# EAGLE design 2023-04-13 LN2 Autofill Connectors (EAGLE 9.6.2)
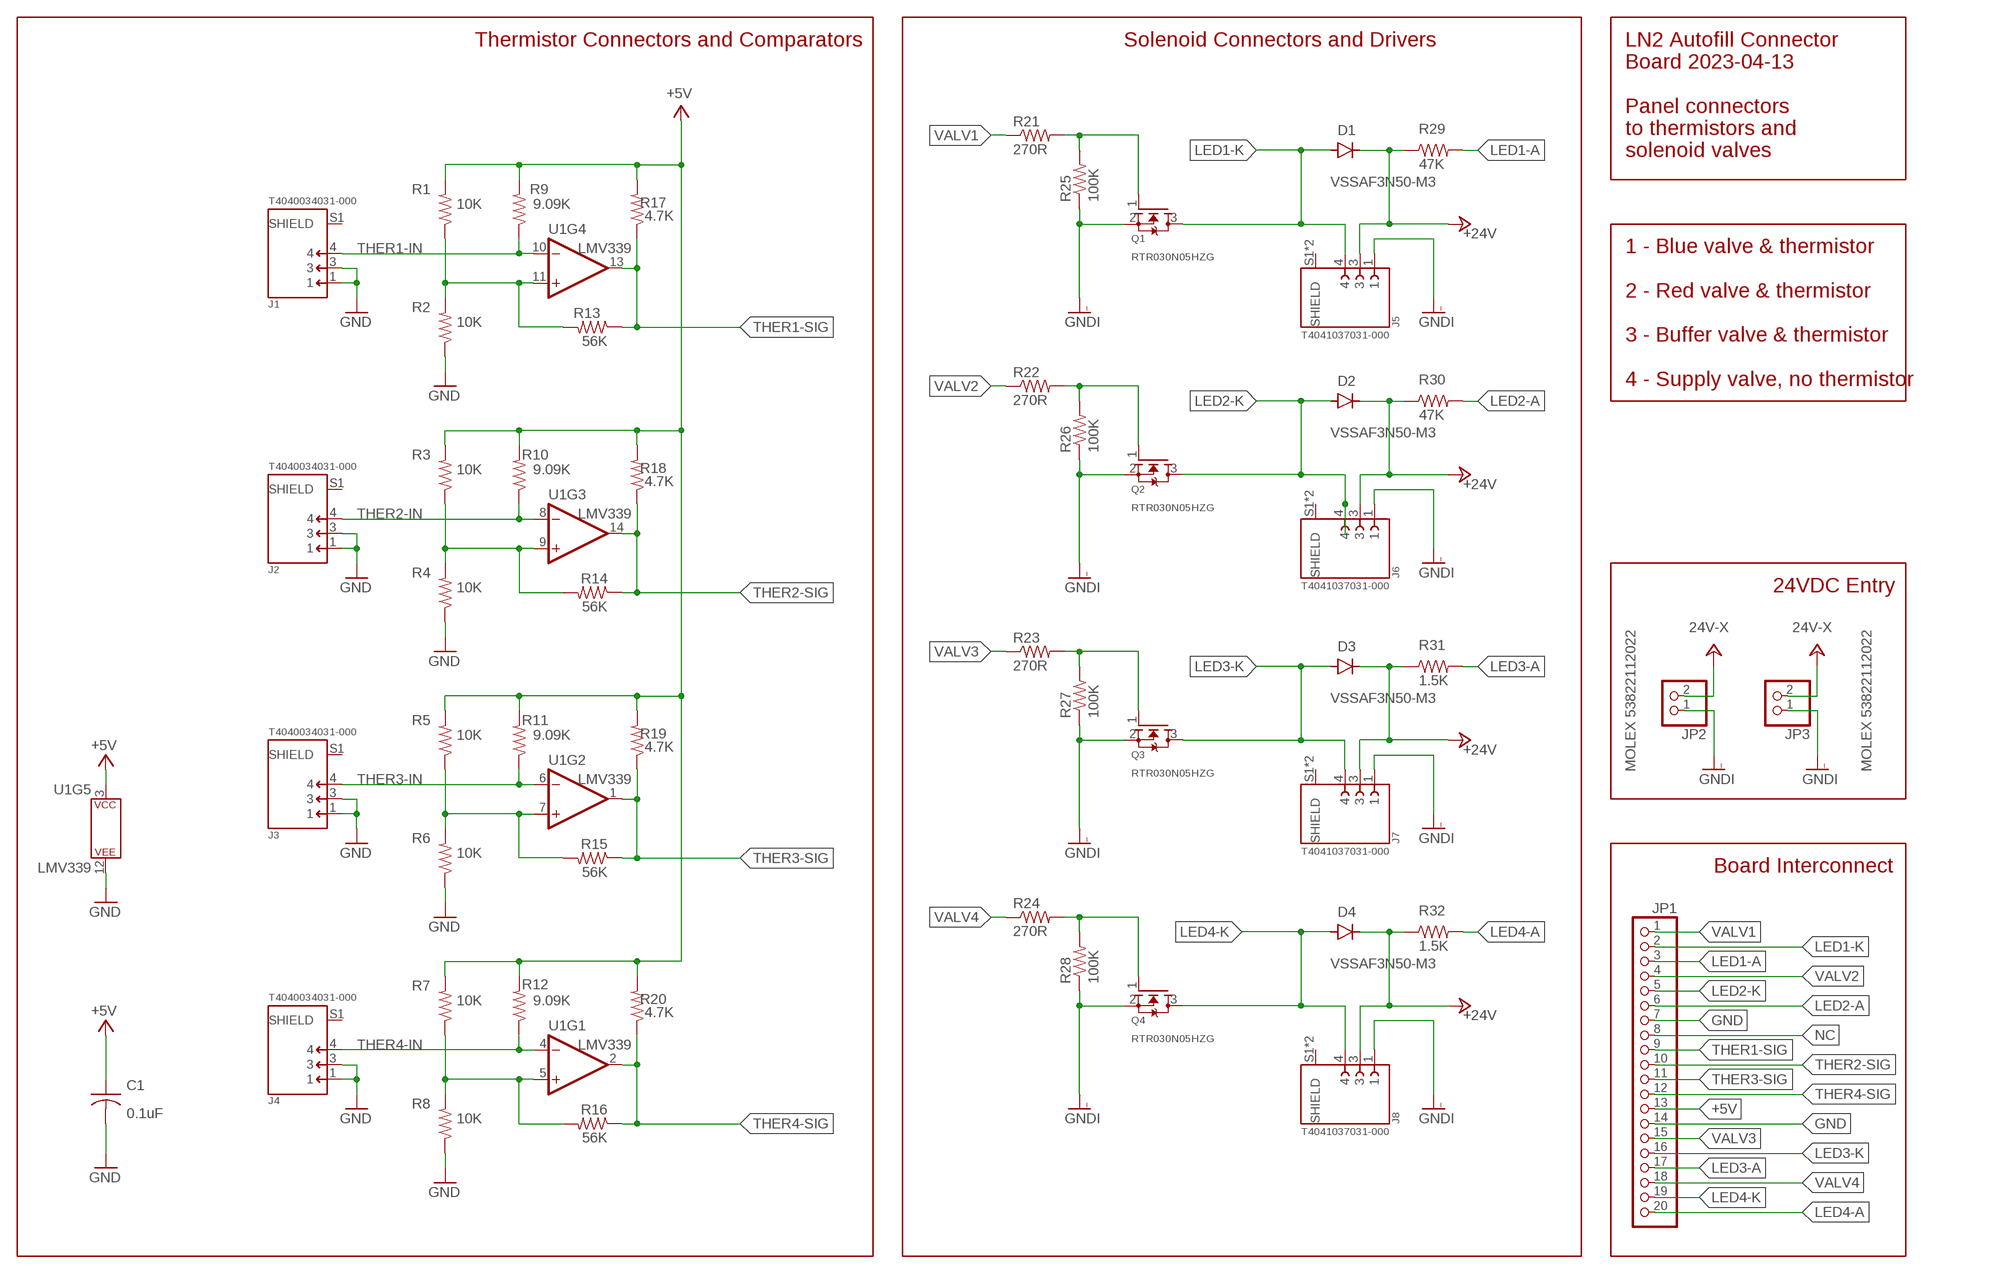
[diagram p0: schematic, sheet 1]

## Parts
C1  0.1uF  C-USC0805  [C0805]
D1  VSSAF3N50-M3  GF1  [SMA-DO214AC]
D2  VSSAF3N50-M3  GF1  [SMA-DO214AC]
D3  VSSAF3N50-M3  GF1  [SMA-DO214AC]
D4  VSSAF3N50-M3  GF1  [SMA-DO214AC]
J1  T4040034031-000  [TE_T4040034031-000]
J2  T4040034031-000  [TE_T4040034031-000]
J3  T4040034031-000  [TE_T4040034031-000]
J4  T4040034031-000  [TE_T4040034031-000]
J5  T4041037031-000  [TE_T4041037031-000]
J6  T4041037031-000  [TE_T4041037031-000]
J7  T4041037031-000  [TE_T4041037031-000]
J8  T4041037031-000  [TE_T4041037031-000]
JP1  PINHD-1X20  [1X20]
JP2  MOLEX 53822112022  PINHD-1X2MOLEX-02-VERT  [MOLEX-02-VERT]
JP3  MOLEX 53822112022  PINHD-1X2MOLEX-02-VERT  [MOLEX-02-VERT]
Q1  RTR030N05HZG  MOSFET-NREFLOW  [SOT23]
Q2  RTR030N05HZG  MOSFET-NREFLOW  [SOT23]
Q3  RTR030N05HZG  MOSFET-NREFLOW  [SOT23]
Q4  RTR030N05HZG  MOSFET-NREFLOW  [SOT23]
R1  10K  R-US_R0805  [R0805]
R2  10K  R-US_R0805  [R0805]
R3  10K  R-US_R0805  [R0805]
R4  10K  R-US_R0805  [R0805]
R5  10K  R-US_R0805  [R0805]
R6  10K  R-US_R0805  [R0805]
R7  10K  R-US_R0805  [R0805]
R8  10K  R-US_R0805  [R0805]
R9  9.09K  R-US_R0805  [R0805]
R10  9.09K  R-US_R0805  [R0805]
R11  9.09K  R-US_R0805  [R0805]
R12  9.09K  R-US_R0805  [R0805]
R13  56K  R-US_R0805  [R0805]
R14  56K  R-US_R0805  [R0805]
R15  56K  R-US_R0805  [R0805]
R16  56K  R-US_R0805  [R0805]
R17  4.7K  R-US_R0805  [R0805]
R18  4.7K  R-US_R0805  [R0805]
R19  4.7K  R-US_R0805  [R0805]
R20  4.7K  R-US_R0805  [R0805]
R21  270R  R-US_R0805  [R0805]
R22  270R  R-US_R0805  [R0805]
R23  270R  R-US_R0805  [R0805]
R24  270R  R-US_R0805  [R0805]
R25  100K  R-US_R0805  [R0805]
R26  100K  R-US_R0805  [R0805]
R27  100K  R-US_R0805  [R0805]
R28  100K  R-US_R0805  [R0805]
R29  47K  R-US_R0805  [R0805]
R30  47K  R-US_R0805  [R0805]
R31  1.5K  R-US_R0805  [R0805]
R32  1.5K  R-US_R0805  [R0805]
U1  LMV339  LM339SOIC-14  [SOIC127P599X175-14]

## Nets
+5V: C1.1 JP1.13 R1.2 R3.2 R5.2 R7.2 R9.2 R10.2 R11.2 R12.2 R17.2 R18.2 R19.2 R20.2 U1.3(P$V+)
+24V: D1.K(C) D2.K(C) D3.K(C) D4.K(C) J5.3 J6.3 J7.3 J8.3 JP2.2 JP3.2 R29.1 R30.1 R31.1 R32.1 ; supply symbol labelled 24V-X
GND: C1.2 J1.1 J1.3 J2.1 J2.3 J3.1 J3.3 J4.1 J4.3 JP1.7 JP1.14 R2.1 R4.1 R6.1 R8.1 U1.12(P$V-)
GNDI: J5.1 J6.1 J7.1 J8.1 JP2.1 JP3.1 Q1.2(S) Q2.2(S) Q3.2(S) Q4.2(S) R25.1 R26.1 R27.1 R28.1
LED1-A: JP1.3 R29.2
LED1-K: D1.A J5.4 JP1.2 Q1.3(D)
LED2-A: JP1.6 R30.2
LED2-K: D2.A J6.4 JP1.5 Q2.3(D)
LED3-A: JP1.17 R31.2
LED3-K: D3.A J7.4 JP1.16 Q3.3(D)
LED4-A: JP1.20 R32.2
LED4-K: D4.A J8.4 JP1.19 Q4.3(D)
N$1: Q1.1(G) R21.2 R25.2
N$2: Q2.1(G) R22.2 R26.2
N$3: Q3.1(G) R23.2 R27.2
N$4: Q4.1(G) R24.2 R28.2
NC: JP1.8
THER1-IN: J1.4 R9.1 U1.10(-IN)
THER1-SIG: JP1.9 R13.1 R17.1 U1.13(OUT)
THER2-IN: J2.4 R10.1 U1.8(-IN)
THER2-SIG: JP1.10 R14.1 R18.1 U1.14(OUT)
THER3-IN: J3.4 R11.1 U1.6(-IN)
THER3-SIG: JP1.11 R15.1 R19.1 U1.1(OUT)
THER4-IN: J4.4 R12.1 U1.4(-IN)
THER4-SIG: JP1.12 R16.1 R20.1 U1.2(OUT)
TRIM1: R1.1 R2.2 R13.2 U1.11(+IN)
TRIM2: R3.1 R4.2 R14.2 U1.9(+IN)
TRIM3: R5.1 R6.2 R15.2 U1.7(+IN)
TRIM4: R7.1 R8.2 R16.2 U1.5(+IN)
VALV1: JP1.1 R21.1
VALV2: JP1.4 R22.1
VALV3: JP1.15 R23.1
VALV4: JP1.18 R24.1
Unconnected: J1.S1(SHIELD) J2.S1(SHIELD) J3.S1(SHIELD) J4.S1(SHIELD) J5.S1(SHIELD) J5.S2(SHIELD) J6.S1(SHIELD) J6.S2(SHIELD) J7.S1(SHIELD) J7.S2(SHIELD) J8.S1(SHIELD) J8.S2(SHIELD)

## Notes on the sheet
- Thermistor Connectors and Comparators | Solenoid Connectors and Drivers
- LN2 Autofill Connector
  Board 2023-04-13
  
  Panel connectors
  to thermistors and
  solenoid valves
- 1 - Blue valve & thermistor
  
  2 - Red valve & thermistor
  
  3 - Buffer valve & thermistor
  
  4 - Supply valve, no thermistor
- 24VDC Entry
- Board Interconnect

## Library data of the parts
C1 = AUmlib:C-US: CAPACITOR, American symbol; SPICEPREFIX: C
D1-D4 = AUmlib:GF1: DIODE
J1-J4 = AUmlib:T4040034031-000: Male Receptacle Connector M8.FMLE.PNLREAR.3POS.STR PCBSHLD 3 POS; MANUFACTURER: TE; MAXIMUM_PACKAGE_HEIGHT: 15.7mm; PARTREV: Rev A; STANDARD: Manufacturer Recommendations
J5-J8 = AUmlib:T4041037031-000: Female Receptacle Connector M8.FMLE.PNLREAR.3POS.STR PCBSHLD 3 POS; MANUFACTURER: TE; MAXIMUM_PACKAGE_HEIGHT: 15.7mm; PARTREV: Rev A; STANDARD: Manufacturer Recommendations
JP1 = AUmlib:PINHD-1X20: PIN HEADER
JP2 JP3 = AUmlib:PINHD-1X2: PIN HEADER
Q1-Q4 = AUmlib:MOSFET-N: N-Channel Mosfet 2N7002E - 60V 260mA SOT23 [Digikey: 2N7002ET1GOSTR-ND] - REEL BSH103 - 30V 850mA SOT23 [Digikey: 568-5013-1-ND]
R1-R32 = AUmlib:R-US_: RESISTOR, American symbol; SPICEPREFIX: R
U1 = AUmlib:LM339: Quad Comparator - LM339PWR Based on information from the SLCS006N datasheet from TI (www.ti.com). Created by nick@scantool.net, 2008. Updated 2016. SparkFun Products SparkFun OBD-II UART <https://www.sparkfun.com/products/9555> (WIG-09555) SparkFun Car Diagnostics Kit <https://www.sparkfun.com/products/10769> (RTL-10769)

## Board
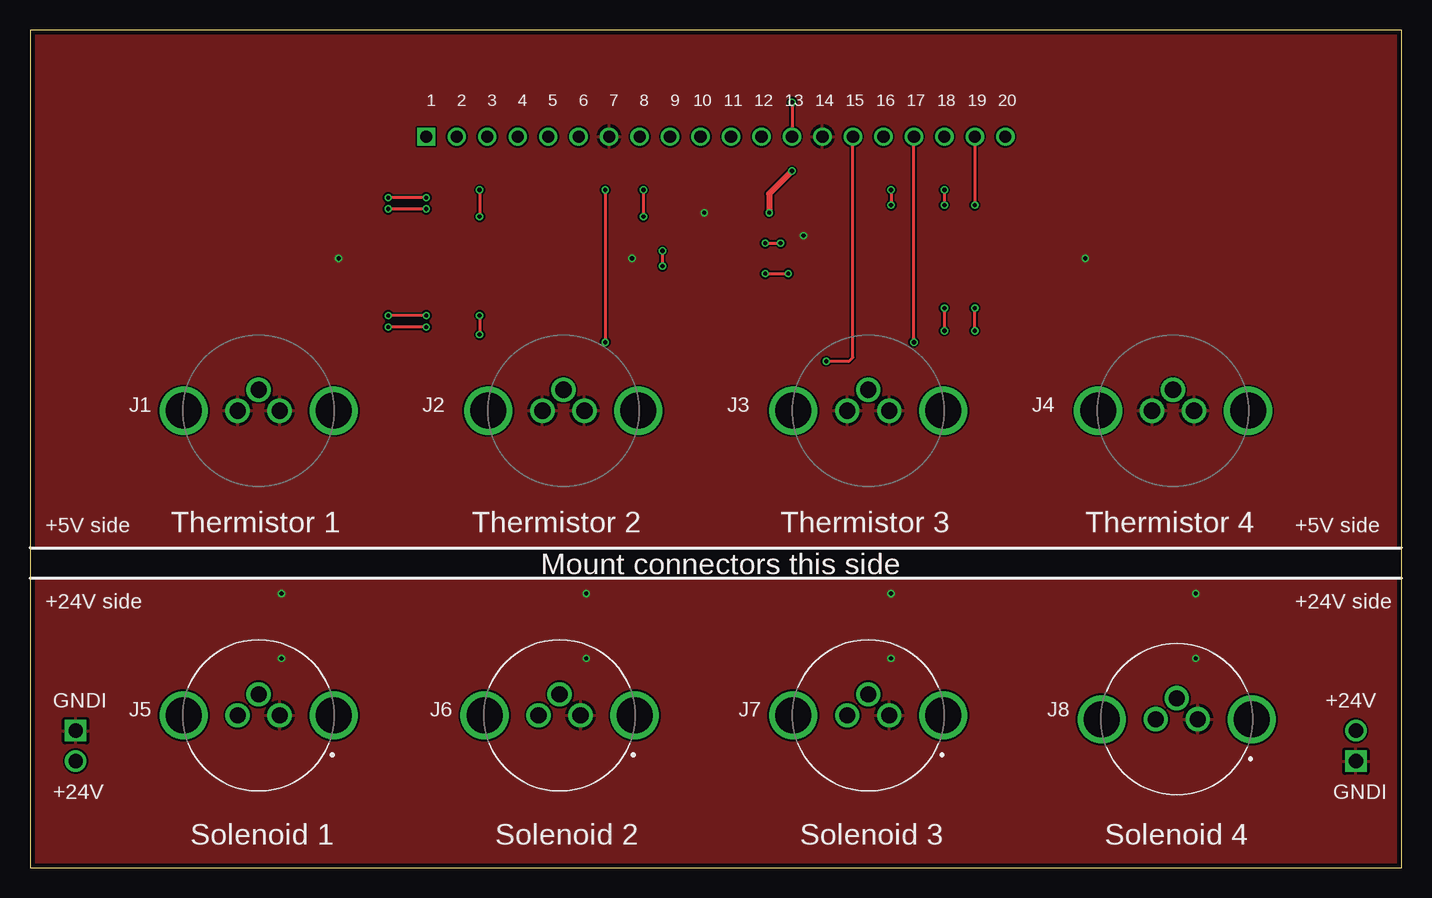
[diagram p1: board, top side]
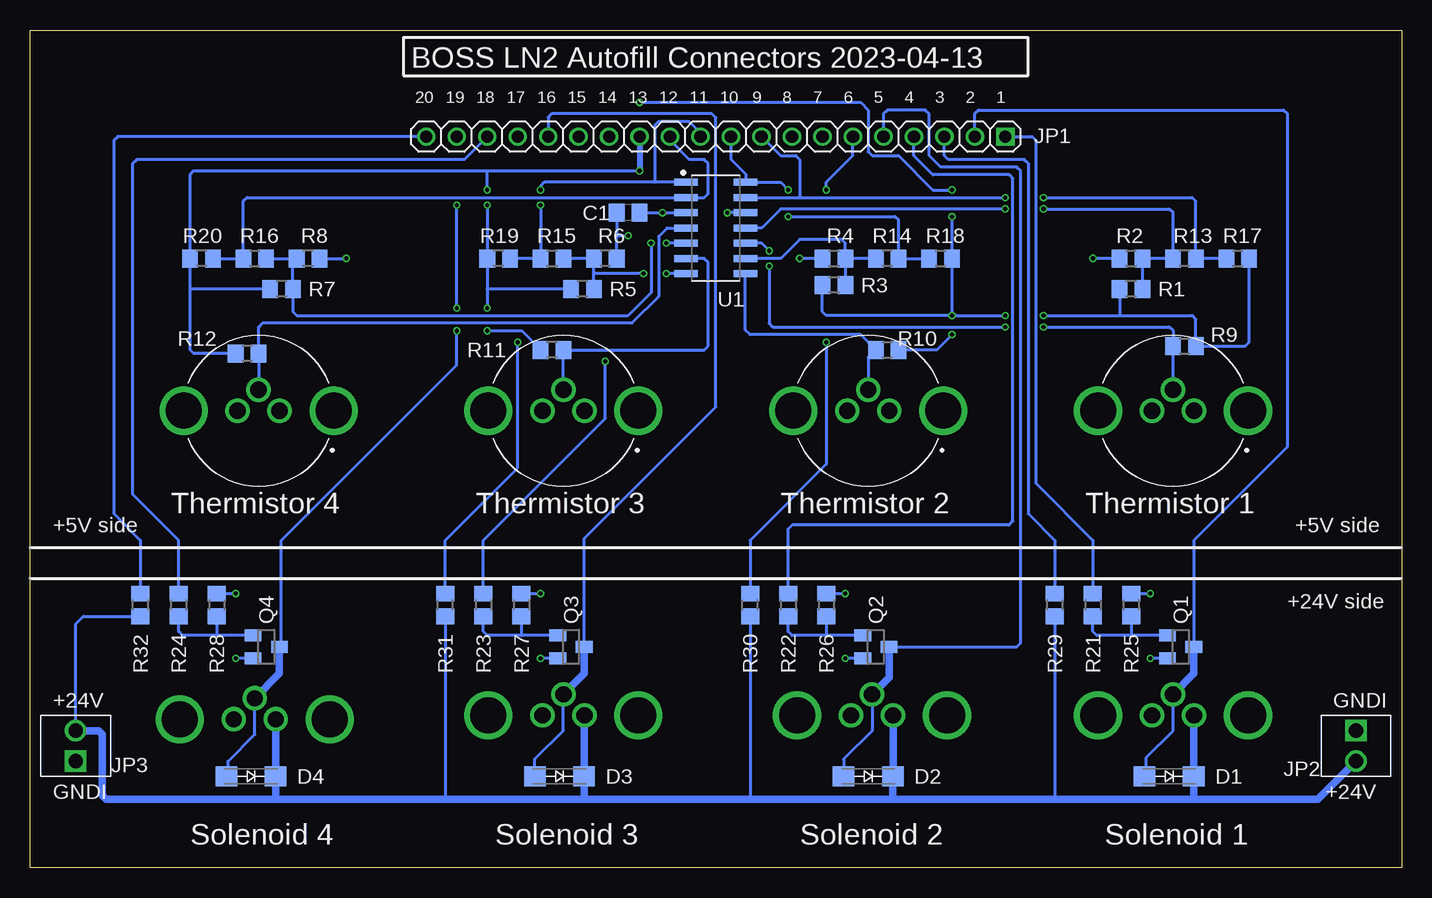
[diagram p2: board, bottom side, seen from below]

Size 114.3 x 69.85 mm. Coordinates in mm from the lower left corner, seen from the top.
Outline: 0,0 114.3,0 114.3,69.85 0,69.85 0,0
Copper layers (1*16): Top 0.035559375mm / dielectric 1.6mm / Bottom 0.035559375mm
Design rules "oshpark-2layer *": minimum track width 6mil, minimum drill 10mil, track to track 6mil, track to pad 6mil, pad to pad 6mil, via to via 6mil, smd to smd 6mil, copper to edge 15mil, drill to drill 6mil, minimum pad ring 5mil, minimum via ring 5mil, stop-mask expansion 2.5mil, vias tented up to drill 0mil, thermal gap 10mil

### Footprints (pad centres in the part's own frame; a part is rotated, then mirrored left to right if it is on the bottom)
C0805 = smd 1.3 x 1.5: 1 -0.95,0; 2 0.95,0
SMA-DO214AC = smd 1.8 x 1.7: A -2.05,0; K 2.05,0
TE_T4040034031-000 = drill 1.35 pad 1.85: 1 -1.75,0; 3 1.75,0; 4 0,1.75 | drill 3: S1 6.25,0; S2 -6.25,0
TE_T4041037031-000 = drill 1.35 pad 1.85: 1 1.75,0; 3 -1.75,0; 4 0,1.75 | drill 3: S1 -6.25,0; S2 6.25,0
1X20 = drill 1.016 square: 1 -24.13,0 | drill 1.016: 2 -21.59,0; 3 -19.05,0; 4 -16.51,0; 5 -13.97,0; 6 -11.43,0; 7 -8.89,0; 8 -6.35,0; 9 -3.81,0; 10 -1.27,0; 11 1.27,0; 12 3.81,0; 13 6.35,0; 14 8.89,0; 15 11.43,0; 16 13.97,0; 17 16.51,0; 18 19.05,0; 19 21.59,0; 20 24.13,0
MOLEX-02-VERT = drill 1.194 square: 1 0,0 | drill 1.194: 2 2.54,0
SOT23 = smd 1 x 1.4: 1 -0.95,-1.1; 2 0.95,-1.1; 3 0,1.1
R0805 = smd 1.3 x 1.5: 1 -0.95,0; 2 0.95,0
SOIC127P599X175-14 = smd 1.967 x 0.594: 1 -2.469,3.81; 2 -2.469,2.54; 3 -2.469,1.27; 4 -2.469,0; 5 -2.469,-1.27; 6 -2.469,-2.54; 7 -2.469,-3.81; 8 2.469,-3.81; 9 2.469,-2.54; 10 2.469,-1.27; 11 2.469,0; 12 2.469,1.27; 13 2.469,2.54; 14 2.469,3.81

### Placement (x,y rotation side)
C1  64.45,54.61 180 bottom
D1  19.37,7.62 0 bottom
D2  44.45,7.62 0 bottom
D3  70.17,7.62 0 bottom
D4  95.89,7.62 0 bottom
J1  19.05,38.1 0 top
J2  44.45,38.1 0 top
J3  69.85,38.1 0 top
J4  95.25,38.1 0 top
J5  19.05,12.7 0 top
J6  44.13,12.7 0 top
J7  69.85,12.7 0 top
J8  95.57,12.38 0 top
JP1  57.15,60.96 180 bottom
JP2  3.81,11.43 270 bottom
JP3  110.49,8.89 90 bottom
Q1  18.41,18.41 270 bottom
Q2  43.81,18.41 270 bottom
Q3  69.22,18.41 270 bottom
Q4  94.61,18.41 270 bottom
R1  22.54,48.26 180 bottom
R2  22.54,50.8 0 bottom
R3  47.31,48.58 180 bottom
R4  47.31,50.8 0 bottom
R5  68.26,48.26 180 bottom
R6  66.36,50.8 180 bottom
R7  93.34,48.26 180 bottom
R8  91.12,50.8 180 bottom
R9  18.1,43.5 0 bottom
R10  42.86,43.18 0 bottom
R11  70.8,43.18 180 bottom
R12  96.2,42.86 180 bottom
R13  18.1,50.8 180 bottom
R14  42.86,50.8 180 bottom
R15  70.8,50.8 0 bottom
R16  95.57,50.8 0 bottom
R17  13.65,50.8 0 bottom
R18  38.42,50.8 0 bottom
R19  75.25,50.8 180 bottom
R20  100.01,50.8 180 bottom
R21  25.72,21.91 270 bottom
R22  51.12,21.91 270 bottom
R23  76.52,21.91 270 bottom
R24  101.92,21.91 270 bottom
R25  22.54,21.91 270 bottom
R26  47.94,21.91 270 bottom
R27  73.34,21.91 270 bottom
R28  98.74,21.91 270 bottom
R29  28.89,21.91 90 bottom
R30  54.29,21.91 90 bottom
R31  79.69,21.91 90 bottom
R32  105.09,21.91 90 bottom
U1  57.15,53.34 0 bottom

### Tracks (layer width: path | path; a pad name or v marks a point on that pad's centre or on a via)
+5V  (via drill 0.35)
  Top 0.254: v37.47,46.04 v37.47,44.45 | v76.2,46.67 v76.2,44.77 | v63.5,63.82 JP1.13 | v33.02,46.04 v29.84,46.04 | v37.47,56.52 v37.47,54.29 | v76.2,56.52 v76.2,55.24
  Top 0.508: v63.5,58.1 61.59,56.2 v61.59,54.61
  Bottom 0.254: 37.15,46.04 37.47,46.36 R18.2 v37.47,54.29 | v37.47,44.45 38.73,43.18 R10.2 | U1.3 v61.59,54.61 C1.1 | 76.2,48.26 76.2,50.16 76.2,50.17 R19.2 v76.2,55.24 | 76.2,48.26 v76.2,46.67 | v76.2,44.77 73.34,44.77 R11.2 | v63.5,63.82 45.09,63.82 44.45,63.18 44.45,59.69 44.13,59.37 41.91,59.37 39.05,56.52 v37.47,56.52 | v29.84,46.04 23.5,46.04 | 23.5,46.04 17.46,46.04 17.14,45.72 R9.2 13.02,43.5 12.7,43.81 R17.2 | 37.15,46.04 v37.47,46.04 47.94,46.04 48.26,46.35 R3.2 | 37.15,46.04 v33.02,46.04 | R1.2 23.5,46.04 | R12.2 100.65,42.86 100.97,43.18 100.97,48.26 | 100.97,48.26 R20.2 100.96,57.79 100.65,58.1 76.2,58.1 | R5.2 76.2,48.26 | R7.2 100.97,48.26 | 76.2,58.1 v63.5,58.1 | v76.2,56.52 76.2,58.1
  Bottom 0.508: JP1.13 v63.5,58.1
+24V
  Bottom 0.254: JP3.2 110.49,20.32 109.85,20.96 R32.1 | R29.1 28.89,5.71 | R30.1 54.29,5.71 | R31.1 79.69,5.71 | 42.4,5.89 42.23,5.71 | 17.32,12.68 J5.3 | D2.K 42.38,7.64 | D3.K 68.1,7.64 | 93.82,7.64 D4.K
  Bottom 0.61: JP2.2 6.99,5.71 17.32,5.71 | 17.32,5.71 28.89,5.71 42.23,5.71 54.29,5.71 68.12,5.71 | 68.12,5.71 79.69,5.71 93.83,5.71 | 93.83,5.71 107.95,5.71 108.27,6.03 108.27,11.11 108.58,11.43 JP3.2 | D3.K 68.12,5.71 | 17.32,5.71 D1.K 17.32,12.68 | D2.K 42.4,5.89 | D4.K 93.83,5.71 | 42.38,7.64 J6.3 | 68.1,7.64 J7.3 | J8.3 93.82,7.64
GND  (via drill 0.35)
  Bottom 0.254: 65.41,52.7 C1.2 | U1.12 v56.2,54.61 | R2.1 v25.72,50.8 | R4.1 v50.16,50.8 | R8.1 v87.95,50.8 | R6.1 65.41,52.7 | 65.41,52.7 v64.45,52.7
  pour Top: 0,69.85 114.3,69.85 114.3,26.67 0,26.67
GNDI  (via drill 0.35)
  Bottom 0.254: Q1.2 v20.95,17.46 | v20.95,22.86 v20.96,22.86 R25.1 | Q2.2 v46.35,17.46 | R26.1 v46.36,22.86 v46.35,22.86 | Q3.2 v71.75,17.46 | R27.1 v71.76,22.86 v71.75,22.86 | Q4.2 v97.16,17.46 | R28.1 v97.16,22.86
  pour Top: 0,0 0,24.13 114.3,24.13 114.3,0
LED1-A
  Bottom 0.254: JP1.3 38.1,59.37 37.78,59.05 31.43,59.05 31.11,58.74 31.11,29.53 28.89,27.3 R29.2
LED1-K
  Bottom 0.254: JP1.2 35.56,62.87 35.24,63.18 9.84,63.18 9.53,62.87 9.53,35.09 17.32,27.3 Q1.3 | D1.A 21.27,7.76 21.27,9.21 19.05,11.43 J5.4
  Bottom 0.61: Q1.3 17.32,16.18 J5.4
LED2-A  (via drill 0.35)
  Top 0.254: v47.94,56.52 v47.94,43.81
  Bottom 0.254: v47.94,56.52 47.94,57.15 45.72,59.37 JP1.6 | v47.94,43.81 47.94,33.66 54.29,27.3 R30.2
LED2-K
  Bottom 0.254: JP1.5 43.18,62.87 42.86,63.18 39.69,63.18 39.37,62.87 39.37,59.37 38.42,58.42 32.07,58.42 31.75,58.1 31.75,18.73 32.07,18.41 Q2.3 | D2.A 46.5,9.06 44.13,11.43 J6.4
  Bottom 0.61: J6.4 42.72,15.87 Q2.3
LED3-A  (via drill 0.35)
  Top 0.254: v73.66,43.81 JP1.17
  Bottom 0.254: v73.66,43.81 73.66,33.34 79.69,27.3 R31.2
LED3-K
  Bottom 0.254: JP1.16 71.12,62.55 70.8,62.87 57.47,62.87 57.15,62.55 57.15,38.42 68.11,27.45 Q3.3 | D3.A 72.22,9.06 69.85,11.43 J7.4
  Bottom 0.61: J7.4 68.11,16.18 Q3.3
LED4-A
  Bottom 0.254: R32.2 105.09,27.3 107.31,29.53 107.31,60.64 107,60.96 JP1.20
LED4-K  (via drill 0.35)
  Top 0.254: v78.74,44.77 v78.74,46.67 | JP1.19 v78.74,55.24
  Bottom 0.254: Q4.3 93.34,18.59 93.34,27.3 78.74,41.91 v78.74,44.77 | v78.74,46.67 v78.74,55.24 | D4.A 97.79,7.76 97.79,8.89 95.57,11.11 J8.4
  Bottom 0.61: J8.4 93.52,16.18 Q4.3
N$1
  Bottom 0.254: Q1.1 22.54,19.36 | 22.54,19.36 25.4,19.36 25.72,19.68 R21.2 | R25.2 22.54,19.36
N$2
  Bottom 0.254: Q2.1 47.94,19.36 | 47.94,19.36 50.8,19.36 51.12,19.68 R22.2 | R26.2 47.94,19.36
N$3
  Bottom 0.254: Q3.1 73.34,19.36 | 73.34,19.36 76.2,19.36 76.52,19.68 R23.2 | R27.2 73.34,19.36
N$4
  Bottom 0.254: Q4.1 98.74,19.37 | 98.74,19.37 101.6,19.37 101.92,19.68 R24.2 | R28.2 98.74,19.37
THER1-IN  (via drill 0.35)
  Top 0.254: v52.7,51.44 v52.7,50.16 | v33.02,45.09 v29.84,45.09
  Bottom 0.254: v52.7,51.44 53.34,52.07 U1.10 | v52.7,50.16 52.7,45.4 52.39,45.09 v33.02,45.09 | v29.84,45.09 19.36,45.09 19.05,44.77 R9.1 J1.4
THER1-SIG  (via drill 0.35)
  Top 0.254: v33.02,55.88 v29.84,55.88
  Bottom 0.254: R17.1 R13.1 17.15,55.56 17.46,55.88 v29.84,55.88 | U1.13 50.16,55.88 | 50.16,55.88 v33.02,55.88 | 50.16,55.88 50.16,59.05 50.48,59.37 51.75,59.37 JP1.9
THER2-IN
  Bottom 0.254: U1.8 54.68,44.84 54.29,44.45 45.08,44.45 R10.1 44.45,42.54 J2.4
THER2-SIG  (via drill 0.35)
  Top 0.254: v51.12,56.52 v51.12,54.29
  Bottom 0.254: JP1.10 55.88,59.05 54.61,57.78 54.61,57.22 U1.14 51.75,57.15 v51.12,56.52 | R18.1 R14.1 41.91,53.98 42.23,54.29 v51.12,54.29
THER3-IN
  Bottom 0.254: U1.6 58.1,50.8 57.78,50.48 57.78,43.5 58.1,43.18 R11.1 J3.4
THER3-SIG  (via drill 0.35)
  Top 0.254: v71.75,56.52 v71.75,55.24
  Bottom 0.254: v71.75,56.52 71.75,56.83 71.44,57.15 62.23,57.15 | v71.75,55.24 R15.1 R19.1 | U1.1 62.23,57.15 | JP1.11 58.42,61.24 59.37,62.19 61.95,62.19 62.23,61.91 62.23,57.15
THER4-IN
  Bottom 0.254: U1.4 61.21,53.34 61.91,52.63 61.91,47.62 64.14,45.4 94.93,45.4 95.25,45.08 R12.1 J4.4
THER4-SIG
  Bottom 0.254: JP1.12 60.96,60.64 59.37,59.05 58.1,59.05 57.78,58.74 57.78,56.2 58.1,55.88 U1.2 96.2,55.88 96.52,55.56 R16.1 R20.1
TRIM1  (via drill 0.35)
  Top 0.254: v33.02,54.93 v29.84,54.93
  Bottom 0.254: v29.84,54.93 19.36,54.93 19.05,54.61 R13.2 R2.2 R1.1 | v33.02,54.93 51.75,54.93 53.34,53.34 U1.11
TRIM2
  Bottom 0.254: R14.2 R4.2 | R4.2 R3.1 | R4.2 46.35,52.07 46.67,52.39 50.16,52.39 51.75,50.8 U1.9
TRIM3  (via drill 0.35)
  Top 0.254: v61.28,49.53 v63.18,49.53
  Bottom 0.254: R6.2 | R6.2 R15.2 | R5.1 67.31,49.53 | 67.31,49.53 R6.2 | U1.7 v61.28,49.53 | v63.18,49.53 67.31,49.53
TRIM4  (via drill 0.35)
  Top 0.254: v61.28,52.07 v62.55,52.07
  Bottom 0.254: R16.2 R8.2 92.39,50.48 R7.1 92.39,46.35 92.08,46.04 64.45,46.04 62.55,47.94 v62.55,52.07 | U1.5 v61.28,52.07
VALV1
  Bottom 0.254: JP1.1 30.8,60.96 30.48,60.64 30.48,32.07 25.72,27.3 R21.1
VALV2
  Bottom 0.254: JP1.4 40.64,59.37 39.05,57.78 32.7,57.78 32.38,57.47 32.38,28.89 32.7,28.57 50.8,28.57 51.12,28.26 R22.1
VALV3  (via drill 0.35)
  Top 0.254: JP1.15 68.58,42.55 68.26,42.23 v66.36,42.23
  Bottom 0.254: v66.36,42.23 66.36,37.47 76.52,27.3 R23.1
VALV4
  Bottom 0.254: R24.1 101.92,27.3 105.73,31.11 105.73,58.74 105.41,59.05 78.11,59.05 JP1.18

### Text on the board
tPlace: 1 | 2 | 3 | 4 | 5 | 6 | 7 | 8 | 9 | 10 | 11 | 12 | 13 | 14 | 15 | 16 | 17 | 18 | 19 | 20 | +5V side | Thermistor 1 | Thermistor 2 | Thermistor 3 | Thermistor 4 | +5V side | Mount connectors this side | +24V side | +24V side | GNDI | +24V | +24V | GNDI | Solenoid 1 | Solenoid 2 | Solenoid 3 | Solenoid 4
bPlace: BOSS LN2 Autofill Connectors 2023-04-13 | 1 | 2 | 3 | 4 | 5 | 6 | 7 | 8 | 9 | 10 | 11 | 12 | 13 | 14 | 15 | 16 | 17 | 18 | 19 | 20 | Thermistor 1 | Thermistor 2 | Thermistor 3 | Thermistor 4 | +5V side | +5V side | +24V side | GNDI | +24V | +24V | GNDI | Solenoid 1 | Solenoid 2 | Solenoid 3 | Solenoid 4